# Altium schematic sheet 0_Rotary_Encoder_Overview.SchDoc
size A4; SheetNumber: 1; SheetTotal: 4
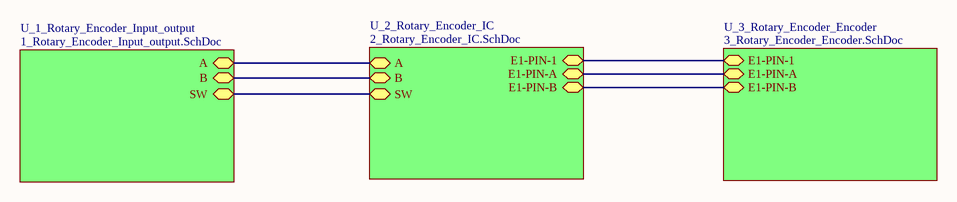
[diagram p0: 0_Rotary_Encoder_Overview.SchDoc]

## Sub-sheets
U_1_Rotary_Encoder_Input_output = 1_Rotary_Encoder_Input_output.SchDoc: A (bidir), SW (bidir), B (bidir)
U_2_Rotary_Encoder_IC = 2_Rotary_Encoder_IC.SchDoc: A (bidir), B (bidir), SW (bidir), E1-PIN-1 (bidir), E1-PIN-B (bidir), E1-PIN-A (bidir)
U_3_Rotary_Encoder_Encoder = 3_Rotary_Encoder_Encoder.SchDoc: E1-PIN-1 (bidir), E1-PIN-A (bidir), E1-PIN-B (bidir)

## Nets
(unnamed): sheet U_1_Rotary_Encoder_Input_output/A, sheet U_2_Rotary_Encoder_IC/A
(unnamed): sheet U_1_Rotary_Encoder_Input_output/SW, sheet U_2_Rotary_Encoder_IC/SW
(unnamed): sheet U_1_Rotary_Encoder_Input_output/B, sheet U_2_Rotary_Encoder_IC/B
(unnamed): sheet U_3_Rotary_Encoder_Encoder/E1-PIN-1, sheet U_2_Rotary_Encoder_IC/E1-PIN-1
(unnamed): sheet U_3_Rotary_Encoder_Encoder/E1-PIN-A, sheet U_2_Rotary_Encoder_IC/E1-PIN-A
(unnamed): sheet U_3_Rotary_Encoder_Encoder/E1-PIN-B, sheet U_2_Rotary_Encoder_IC/E1-PIN-B